# Altium schematic sheet connectors.SchDoc
size 594 x 420 mm; Address1: Address1; Address2: Address2; Address3: Address3; Address4: Address4; DocumentNumber: 5; SheetNumber: 5; SheetTotal: 6; Перв_применение: Э3
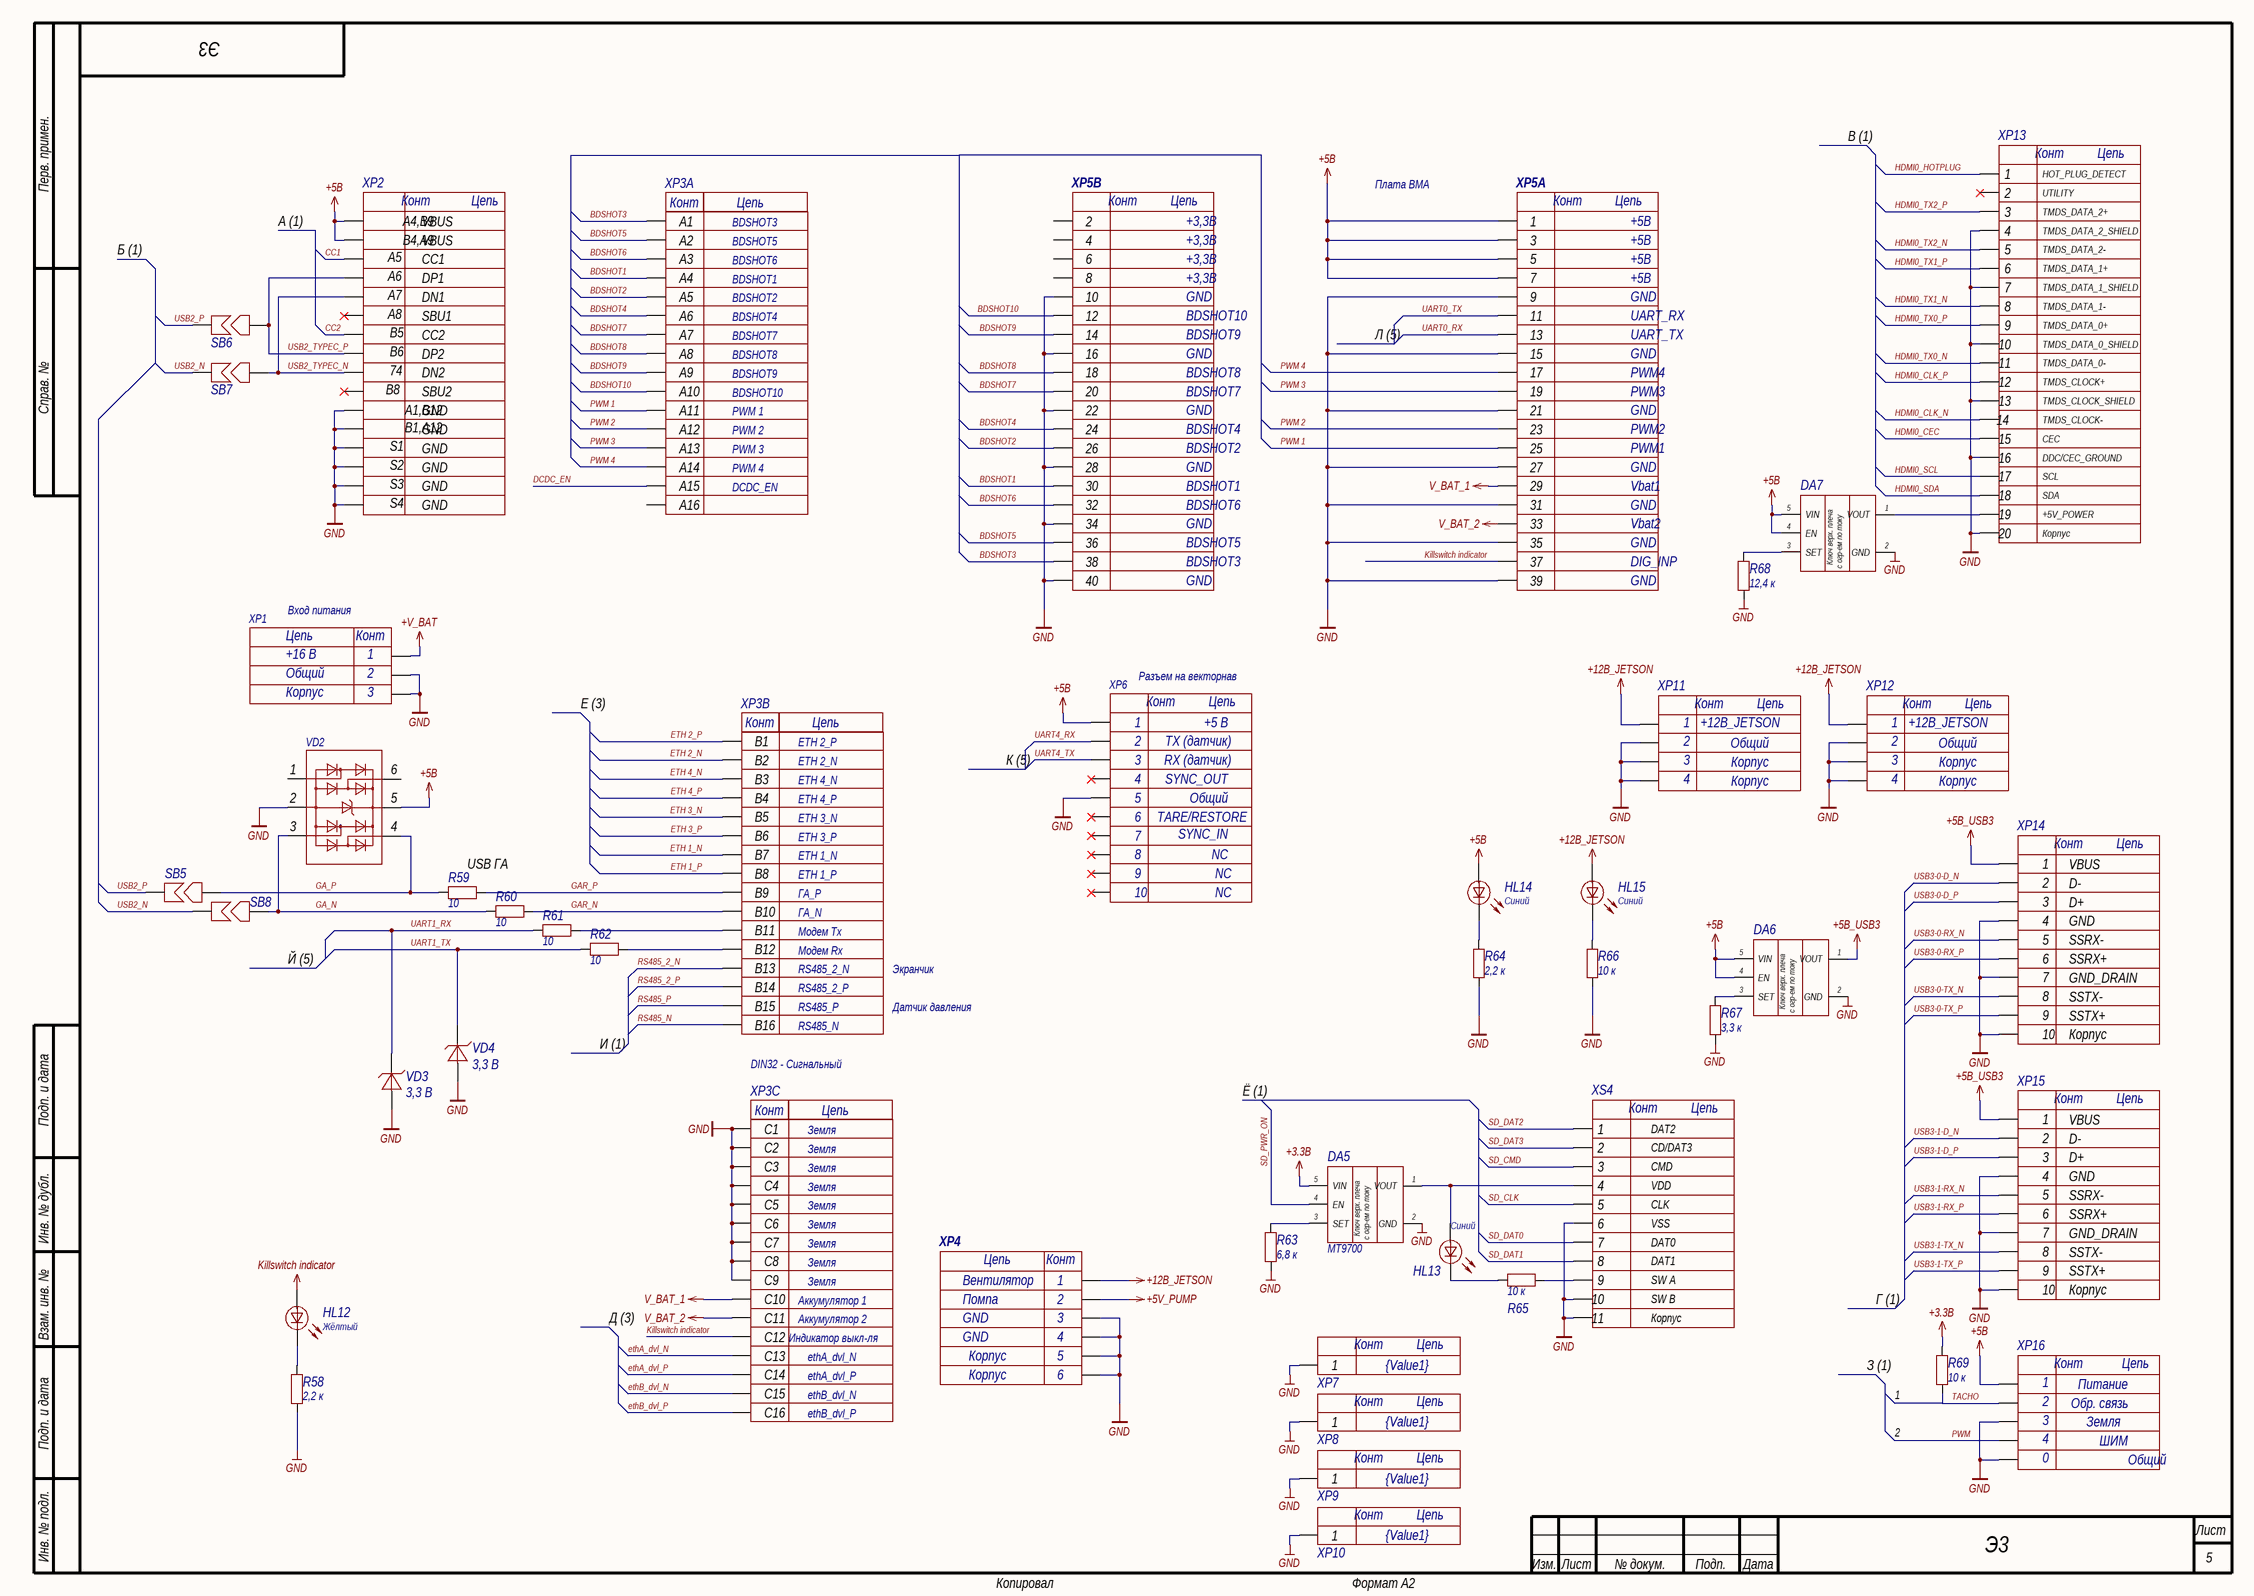
[diagram p0: connectors.SchDoc]

## Parts
DA5  MT9700  [SOT23-5]
DA6  MT9700  [SOT23-5]  (value not drawn)
DA7  MT9700  [SOT23-5]  (value not drawn)
HL12  value Жёлтый  [0603D_yellow]  (hidden comment: LED 0603 YELLOW)
HL13  value Синий  [0603D_blue]  (hidden comment: LED 0603 BLUE)
HL14  value Синий  [0603D_blue]  (hidden comment: LED 0603 BLUE)
HL15  value Синий  [0603D_blue]  (hidden comment: LED 0603 BLUE)
R58  value 2,2 к  [0603R]  (hidden comment: Resistor)
R59  value 10  [0603R]  (hidden comment: Resistor)
R60  value 10  [0603R]  (hidden comment: Resistor)
R61  value 10  [0603R]  (hidden comment: Resistor)
R62  value 10  [0603R]  (hidden comment: Resistor)
R63  value 6,8 к  [0603R]  (hidden comment: Resistor)
R64  value 2,2 к  [0603R]  (hidden comment: Resistor)
R65  value 10 к  [0603R]  (hidden comment: Resistor)
R66  value 10 к  [0603R]  (hidden comment: Resistor)
R67  value 3,3 к  [0603R]  (hidden comment: Resistor)
R68  value 12,4 к  [0603R]  (hidden comment: Resistor)
R69  value 10 к  [0603R]  (hidden comment: Resistor)
SB5  SB  [0603SB]  (value not drawn)  (net tie, no BOM)
SB6  SB  [0603SB]  (value not drawn)  (net tie, no BOM)
SB7  SB  [0603SB]  (value not drawn)  (net tie, no BOM)
SB8  SB  [0603SB]  (value not drawn)  (net tie, no BOM)
VD2  USBLC6-4  [SOT23-6]  (value not drawn)
VD3  value 3,3 В  [SOD523]  (hidden comment: PESD3V3L1UB)
VD4  value 3,3 В  [SOD523]  (hidden comment: PESD3V3L1UB)
XP1  Value3: Корпус  Value2: Общий  Value1: +16 В  [XT30PW-M]  (hidden comment: XT30PW-M)
XP2  USB_type_C_16PF-026  [16PF-026]  (value not drawn)
XP3  DIN41612_48_3row_right_angle_male  [DIN41612_48_3row_right_angle_male]  (value not drawn)  (parts A,B,C of 3)
XP4  Value1: Вентилятор  Value2: Помпа  Value3: GND  [MOLEX_430450418]  (hidden comment: 430450418)
XP5  DF40C-40DS  [DF40C-40DS]  (value not drawn)  (parts A,B of 2)
XP6  Value1: +5 В  Value2: TX (датчик)  Value3: RX (датчик)  Value4: SYNC_OUT  Value5: Общий  Value6: TARE/RESTORE  Value7: SYNC_IN  Value8: NC  [M80-4001042_govnodelie]  (hidden comment: M80-4001042)
XP7  Value1: {Value1}  [9774015151]  (hidden comment: SMT-NUT-M2H1.5)
XP8  Value1: {Value1}  [9774015151]  (hidden comment: SMT-NUT-M2H1.5)
XP9  Value1: {Value1}  [9774015151]  (hidden comment: SMT-NUT-M2H1.5)
XP10  Value1: {Value1}  [9774015151]  (hidden comment: SMT-NUT-M2H1.5)
XP11  Value3: Корпус  Value2: Общий  Value1: +12В_JETSON  [Molex_430450218]  (hidden comment: 430450218)
XP12  Value3: Корпус  Value2: Общий  Value1: +12В_JETSON  [Molex_430450218]  (hidden comment: 430450218)
XP13  467650001  [467650001]  (value not drawn)
XP14  USB 3.0A DS1095-05  [USB3.0A_DS1095-05]  (value not drawn)
XP15  USB 3.0A DS1095-05  [USB3.0A_DS1095-05]  (value not drawn)
XP16  Value3: Земля  Value2: Обр. связь  Value4: ШИМ  Value1: Питание  [BM04B-SRSS-TB]  (hidden comment: BM04B-SRSS-TB)
XS4  DM3AT-SF-PEJM5  [DM3AT-SF-PEJM5]  (value not drawn)

## Nets
+3.3В: DA5.5(VIN) R69.2
+5V_PUMP: XP4.2
+5В: DA6.4(EN) DA6.5(VIN) DA7.4(EN) DA7.5(VIN) HL14.1 VD2.5 XP2.A4/B9(VBUS) XP2.B4/A9(VBUS) XP5.1 XP5.3 XP5.5 XP5.7 XP6.1 XP16.1
+5В_USB3: DA6.1(VOUT) XP14.1(VBUS) XP15.1(VBUS)
+12В_JETSON: HL15.1 XP4.1 XP11.1 XP12.1
+V_BAT: XP1.P
GND: DA5.2(GND) DA6.2(GND) DA7.2(GND) R58.1 R63.1 R64.1 R66.1 R67.1 R68.1 VD2.2 VD3.1 VD4.1 XP1.0 XP1.N XP2.A1/B12(GND) XP2.B1/A12(GND) XP2.S1(GND) XP2.S2(GND) XP2.S3(GND) XP2.S4(GND) XP3.C1 XP3.C2 XP3.C3 XP3.C4 XP3.C5 XP3.C6 XP3.C7 XP3.C8 XP3.C9 XP4.0 XP4.3 XP4.4 XP5.9 XP5.10 XP5.15 XP5.16 XP5.21 XP5.22 XP5.27 XP5.28 XP5.31 XP5.34 XP5.35 XP5.39 XP5.40 XP6.5 XP7.1 XP8.1 XP9.1 XP10.1 XP11.0 XP11.2 XP12.0 XP12.2 XP13.4(TMDS_DATA_2_SHIELD) XP13.7(TMDS_DATA_1_SHIELD) XP13.10(TMDS_DATA_0_SHIELD) XP13.13(TMDS_CLOCK_SHIELD) XP13.16(DDC/CEC_GROUND) XP13.SH(Корпус) XP14.0(Корпус) XP14.4(GND) XP14.7(GND_DRAIN) XP15.0(Корпус) XP15.4(GND) XP15.7(GND_DRAIN) XP16.0 XP16.3 XS4.6(VSS) XS4.SH(Корпус) XS4.SWB(SW_B)
Killswitch indicator: HL12.1 XP3.C12 XP5.37
V_BAT_1: XP3.C10 XP5.29
V_BAT_2: XP3.C11 XP5.33
BDSHOT1: XP3.A4 XP5.30
BDSHOT2: XP3.A5 XP5.26
BDSHOT3: XP3.A1 XP5.38
BDSHOT4: XP3.A6 XP5.24
BDSHOT5: XP3.A2 XP5.36
BDSHOT6: XP3.A3 XP5.32
BDSHOT7: XP3.A7 XP5.20
BDSHOT8: XP3.A8 XP5.18
BDSHOT9: XP3.A9 XP5.14
BDSHOT10: XP3.A10 XP5.12
CC1: XP2.A5(CC1)
CC2: XP2.B5(CC2)
DCDC_EN: XP3.A15
ETH 1_N: XP3.B7
ETH 1_P: XP3.B8
ETH 2_N: XP3.B2
ETH 2_P: XP3.B1
ETH 3_N: XP3.B5
ETH 3_P: XP3.B6
ETH 4_N: XP3.B3
ETH 4_P: XP3.B4
ethA_dvl_N: XP3.C13
ethA_dvl_P: XP3.C14
ethB_dvl_N: XP3.C15
ethB_dvl_P: XP3.C16
GA_N: R60.1 SB8.1 VD2.3
GA_P: R59.1 SB5.1 VD2.4
GAR_N: R60.2 XP3.B10
GAR_P: R59.2 XP3.B9
HDMI0_CEC: XP13.15(CEC)
HDMI0_CLK_N: XP13.14(TMDS_CLOCK-)
HDMI0_CLK_P: XP13.12(TMDS_CLOCK+)
HDMI0_HOTPLUG: XP13.1(HOT_PLUG_DETECT)
HDMI0_SCL: XP13.17(SCL)
HDMI0_SDA: XP13.18(SDA)
HDMI0_TX0_N: XP13.11(TMDS_DATA_0-)
HDMI0_TX0_P: XP13.9(TMDS_DATA_0+)
HDMI0_TX1_N: XP13.8(TMDS_DATA_1-)
HDMI0_TX1_P: XP13.6(TMDS_DATA_1+)
HDMI0_TX2_N: XP13.5(TMDS_DATA_2-)
HDMI0_TX2_P: XP13.3(TMDS_DATA_2+)
PWM: XP16.4
PWM 1: XP3.A11 XP5.25
PWM 2: XP3.A12 XP5.23
PWM 3: XP3.A13 XP5.19
PWM 4: XP3.A14 XP5.17
RS485_2_N: XP3.B13
RS485_2_P: XP3.B14
RS485_N: XP3.B16
RS485_P: XP3.B15
SD_CLK: XS4.5(CLK)
SD_CMD: XS4.3(CMD)
SD_DAT0: XS4.7(DAT0)
SD_DAT1: XS4.8(DAT1)
SD_DAT2: XS4.1(DAT2)
SD_DAT3: XS4.2(CD/DAT3)
SD_PWR_ON: DA5.4(EN)
TACHO: R69.1 XP16.2
UART0_RX: XP5.13
UART0_TX: XP5.11
UART1_RX: R61.1 VD3.2
UART1_TX: R62.1 VD4.2
UART4_RX: XP6.2
UART4_TX: XP6.3
USB2_N: SB7.2 SB8.2
USB2_P: SB5.2 SB6.2
USB2_TYPEC_N: SB7.1 XP2.A7(DN1) XP2.B7(DN2)
USB2_TYPEC_P: SB6.1 XP2.A6(DP1) XP2.B6(DP2)
USB3-0-D_N: XP14.2(D-)
USB3-0-D_P: XP14.3(D+)
USB3-0-RX_N: XP14.5(SSRX-)
USB3-0-RX_P: XP14.6(SSRX+)
USB3-0-TX_N: XP14.8(SSTX-)
USB3-0-TX_P: XP14.9(SSTX+)
USB3-1-D_N: XP15.2(D-)
USB3-1-D_P: XP15.3(D+)
USB3-1-RX_N: XP15.5(SSRX-)
USB3-1-RX_P: XP15.6(SSRX+)
USB3-1-TX_N: XP15.8(SSTX-)
USB3-1-TX_P: XP15.9(SSTX+)
NetDA5_1: DA5.1(VOUT) HL13.1 XS4.4(VDD)
NetDA5_3: DA5.3(SET) R63.2
NetDA6_3: DA6.3(SET) R67.2
NetDA7_1: DA7.1(VOUT) XP13.19(+5V_POWER)
NetDA7_3: DA7.3(SET) R68.2
NetHL12_2: HL12.2 R58.2
NetHL13_2: HL13.2 R65.1
NetHL14_2: HL14.2 R64.2
NetHL15_2: HL15.2 R66.2
NetR61_2: R61.2 XP3.B11
NetR62_2: R62.2 XP3.B12
NetR65_2: R65.2 XS4.SWA(SW_A)

Not connected (* = marked no-connect by the designer): VD2 1(9) 6(14); XP2 A8(SBU1)* B8(SBU2)*; XP3 A16; XP5 2 4 6 8; XP6 4* 6* 7* 8* 9* 10*; XP13 2(UTILITY)*

## Notes on the sheet
- В (1)
- Плата ВМА
- Б (1)
- А (1)
- BDSHOT3
- BDSHOT5
- BDSHOT6
- BDSHOT1
- BDSHOT2
- BDSHOT4
- BDSHOT7
- BDSHOT8
- Л (5)
- BDSHOT9
- BDSHOT10
- PWM 1
- PWM 2
- PWM 3
- PWM 4
- DCDC_EN
- Вход питания
- Разъем на векторнав
- Е (3)
- ETH 2_P
- ETH 2_N
- ETH 4_N
- К (5)
- ETH 4_P
- ETH 3_N
- ETH 3_P
- (near R59) USB ГА
- ETH 1_N
- ETH 1_P
- ГА_P
- ГА_N
- Модем Tx
- Й (5)
- Модем Rx
- RS485_2_N
- Экранчик
- RS485_N
- RS485_P
- RS485_2_P
- Датчик давления
- И (1)
- (near XP3) DIN32 - Сигнальный
- Ё (1)
- Земля
- Д (3)
- Аккумулятор 1
- Аккумулятор 2
- Г (1)
- (near XP3) Индикатор выкл-ля
- ethA_dvl_N
- З (1)
- ethB_dvl_P
- ethB_dvl_N
- ethA_dvl_P
- 1
- 2
- Перв. примен.
- Справ. №
- Подп. и дата
- Инв. № дубл.
- Взам. инв. №
- Инв. № подл.
- Изм.
- Лист
- № докум.
- Подп.
- Дата
- Копировал
- Формат А2
- (in symbol 467650001_microHDMI) Конт; Цепь; 20
- (in symbol BM04B-SRSS-TB) Конт; Цепь; Общий
- (in symbol DF40C-40DS, part A) Конт; Цепь; +5В; GND; UART_RX; UART_TX; PWM4; PWM3; PWM2; PWM1; Vbat1; Vbat2; DIG_INP
- (in symbol DF40C-40DS, part B) Конт; Цепь; +3,3В; GND; BDSHOT10; BDSHOT9; BDSHOT8; BDSHOT7; BDSHOT4; BDSHOT2; BDSHOT1; BDSHOT6; BDSHOT5; BDSHOT3
- (in symbol DIN41612_48_3row_right_angle_male, part A) Конт; Цепь
- (in symbol DIN41612_48_3row_right_angle_male, part B) Конт; Цепь
- (in symbol DIN41612_48_3row_right_angle_male, part C) Конт; Цепь
- (in symbol DM3AT-SF-PEJM5) Конт; Цепь; 9; 10; 11
- (in symbol Fucking M80-4001042) Конт; Цепь
- (in symbol Molex_430450218) Конт; Цепь; 3; 4
- (in symbol Molex_430450418) Цепь; Конт; Корпус; 5; 6
- (in symbol MT9700) Ключ верх. плеча; с огр-ем по току
- (in symbol SMT-NUT-M2H1.5) Конт; Цепь
- (in symbol USB 3.0A DS1095-05) Конт; Цепь; 10
- (in symbol USB_type_C_16PF-026) Конт; Цепь; A4,B9; B4,A9; 74; A1,B12; B1,A12
- (in symbol XT30PW-M) Цепь; Конт; 1; 2; 3

## Library data of the parts
DA5-DA7 = MT9700: Силовой ключ с настраиваемым ограничением тока, 2А(max), SOT-23-5; Автор: rreali; Part Number: MT9700; Datasheet: https://static.chipdip.ru/lib/498/DOC013498591.pdf
HL12 = LED 0603 YELLOW: Светодиод 0603 Жёлтый; Автор: rreali; Part Number: LED 0603 YELLOW
HL13-HL15 = LED 0603 BLUE: Светодиод 0603 Синий; Автор: rreali; Part Number: LED 0603 BLUE
R58 R64 = Resistor_2.2k_1_0603: Резистор номиналом 2,2 кОм 1%; Power: *; Part Number: Resistor_2.2k_1_0603; Tolerance: 1%
R59-R62 = Resistor_10_1_0603: Резистор номиналом 10 Ом 1%; Power: *; Part Number: Resistor_10_1_0603; Tolerance: 1%
R63 = Resistor_6.8k_1_0603: Резистор номиналом 6,8 кОм 1%; Power: *; Part Number: Resistor_6.8k_1_0603; Tolerance: 1%
R65 R66 R69 = Resistor_10k_1_0603: Резистор номиналом 10 кОм 1%; Power: *; Part Number: Resistor_10k_1_0603; Tolerance: 1%
R67 = Resistor_3.3k_1_0603: Резистор номиналом 3,3 кОм 1%; Power: *; Part Number: Resistor_3.3k_1_0603; Tolerance: 1%
R68 = Resistor_12.4k_1_0603: Резистор номиналом 12,4 кОм 1%; Power: *; Part Number: Resistor_12.4k_1_0603; Tolerance: 1%
SB5-SB8 = SB: Solder bridge, мост припоя, запаиваемая перемычка, net tie, jumper; Автор: rreali; Part Number: SB
VD2 = USBLC6-4: Сборка защитных диодов для USB; ComponentLink1Description: Shop; ComponentLink1URL: https://www.chipdip.ru/product0/8001780508; Part Number: USBLC6-4
VD3 VD4 = PESD3V3L1UB: Защитный диод на 3,3 В, рассеиваемая мощность 45 Вт; Voltage (V): 3,3; Power (W): 45; Автор: glebmih; Part Number: PESD3V3L1UB
XP1 = XT30PW-M: 30 А (15 продолжительно), 2 контакта разъем угловой отец; System: Connector; Автор: rreali; Part Number: XT30PW-M
XP2 = USB_type_C_16PF-026: USB2.0 TYPE-C 16PF-026, Разъём USB TYPE-C - розетка в плату; System: Connector; Автор: rreali; Part Number: USB_type_C_16PF-026; Datasheet: https://ruichi.ru/files/107841-716042290d9ed014628a96fd01272154.pdf
XP3 = DIN41612_48_3row_right_angle_male: DIN41612R (DS1120-48M0R13), Разъем (вилка) тип B 48pin (3х16), шаг 2.54мм трехрядный угловой (ряд АВC); Parameter 14: {Value}; System: Connector; Автор: glebmih; Parameter 16: {Value}; Parameter 15: {Value}; Parameter 12: {Value}; Parameter 13: {Value}; Parameter 11: {Value}; Parameter 10: {Value}; Parameter 9: {Value}; Parameter 8: {Value}; Parameter 5: {Value}; Parameter 6: {Value}; Parameter 7: {Value}; Parameter 4: {Value}; Parameter 3: {Value}; Parameter 2: {Value}; Parameter 1: {Value}; Part Number: DIN41612_48_3row_right_angle_male; Datasheet: https://cdn.promelec.ru/upload/datasheet/3/1/DS1120.pdf
XP4 = Molex_430450418: Разъем типа провод-плата, 3 мм, 4 контакт(-ов), Штыревой Разъем, для поверностного монтажа; System: Connector; Автор: rreali; Value4: GND; Part Number: Molex_430450418
XP5 = DF40C-40DS: Thruster control PCB
XP6 = Fucking M80-4001042: 5+5-контактный гнездовой DIL-разъём с вертикальным сквозным креплением. Посадочное под нестандартные длинные винты м2, чтобы шляпка винта прижималась к плате, а не к разъему. Так выше жесткость.; System: Connector; Автор: rreali; Value9: NC; Value10: NC; Part Number: Fucking M80-4001042; Datasheet: https://www.harwin.com/products/M80-4001042
XP7-XP10 = SMT-NUT-M2H1.5: Стойка под пайку, М2, высота 1.5 мм, SMT spacer nut - ключевые слова, Hangzhou WildChip Tech Co., Ltd. Store магазин на алике; Автор: glebmih; Part Number: SMT-NUT-M2H1.5; Datasheet: https://aliexpress.ru/item/1005005620368789.html?sku_id=12000033777723210&srcSns=sns_More&businessType=ProductDetail&spreadType=socialShare&tt=MG&utm_medium=sharing
XP11 XP12 = Molex_430450218: Разъем типа провод-плата, 3 мм, 2 контакт(-ов), Штыревой Разъем, Серия Micro-Fit для поверхностного монтажа; System: Connector; Автор: rreali; Value4: Корпус; Part Number: Molex_430450218
XP13 = 467650001_microHDMI: Разъем Micro HDMI с шагом контактов 0,40 мм, угловой разъем, для поверхностного монтажа, 19 контактов; System: Connector; Автор: rreali; Part Number: 467650001_microHDMI; Datasheet: https://www.molex.com/content/dam/molex/molex-dot-com/products/automated/en-us/salesdrawingpdf/467/46765/467650001_sd.pdf?inline
XP14 XP15 = USB 3.0A DS1095-05: Разъем USB 3.0 тип A, 9 контактов, мама, угловой.; System: Connector; Автор: rreali; Part Number: USB 3.0A DS1095-05; Datasheet: https://static.chipdip.ru/lib/553/DOC059553898.pdf
XP16 = BM04B-SRSS-TB: Разъем штыревой на плату, поверхностый монтаж, вертикальный, 4 контакта, шаг 1 мм; System: Connector; Автор: rreali; Part Number: BM04B-SRSS-TB; Datasheet: https://static.chipdip.ru/lib/149/DOC007149929.pdf
XS4 = DM3AT-SF-PEJM5: Разъем для microSD карты памяти угл.8к.1.1мм SMT; System: Connector; Автор: rreali; Part Number: DM3AT-SF-PEJM5; Datasheet: https://static.chipdip.ru/lib/795/DOC059795377.pdf